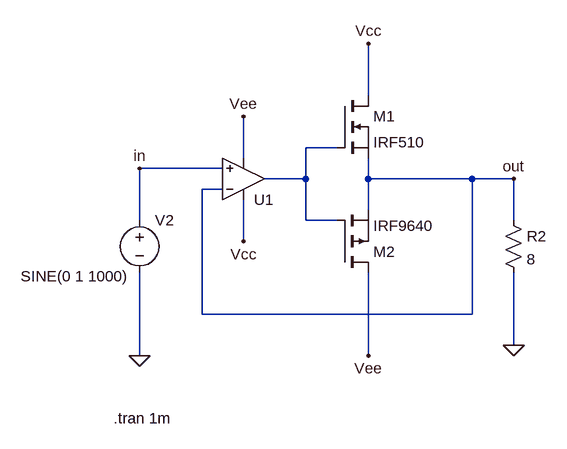
[diagram p0: schematic opamp_model1b.asc]
opamp_model1b.asc, the LTspice schematic file:
Version 4.1
SHEET 1 1416 1140
WIRE 1136 -432 1136 -512
WIRE 1088 -352 1040 -352
WIRE 944 -336 944 -400
WIRE 912 -320 784 -320
WIRE 1040 -304 1040 -352
WIRE 1040 -304 976 -304
WIRE 1136 -304 1136 -336
WIRE 1296 -304 1136 -304
WIRE 1360 -304 1296 -304
WIRE 912 -288 880 -288
WIRE 1136 -256 1136 -304
WIRE 784 -240 784 -320
WIRE 1040 -240 1040 -304
WIRE 1088 -240 1040 -240
WIRE 1360 -240 1360 -304
WIRE 944 -208 944 -272
WIRE 880 -96 880 -288
WIRE 1296 -96 1296 -304
WIRE 1296 -96 880 -96
WIRE 1360 -48 1360 -160
WIRE 784 -32 784 -160
WIRE 1136 -32 1136 -160
FLAG 784 -32 0
FLAG 1136 -512 Vcc
FLAG 1136 -32 Vee
FLAG 1360 -48 0
FLAG 1360 -304 out
FLAG 784 -320 in
FLAG 944 -400 Vee
FLAG 944 -208 Vcc
SYMBOL voltage 784 -256 R0
WINDOW 3 -183 102 Left 2
SYMATTR InstName V2
SYMATTR Value SINE(0 1 1000)
SYMBOL nmos 1088 -432 R0
SYMATTR InstName M1
SYMATTR Value IRF510
SYMBOL pmos 1088 -160 M180
SYMATTR InstName M2
SYMATTR Value IRF9640
SYMBOL res 1344 -256 R0
SYMATTR InstName R2
SYMATTR Value 8
SYMBOL OpAmps\\UniversalOpAmp 944 -304 M180
SYMATTR InstName U1
TEXT 744 64 Left 2 !.tran 1m

The netlist it stands for:
* opamp_model1b.asc
V2 in 0 SINE(0 1 1000)
M1 Vcc N001 out out IRF510
M2 Vee N001 out out IRF9640
R2 out 0 8
X§U1 in out Vcc Vee N001 level1 Avol=1Meg GBW=10Meg Vos=0 En=0 Enk=0 In=0 Ink=0 Rin=500Meg  ; pins In+ In- V+ V- OUT
.model NMOS NMOS
.model PMOS PMOS
.lib standard.mos
.tran 1m
.lib UniversalOpAmp1.lib
.backanno
.end